# Altium schematic sheet Schematic1.SchDoc
size A4
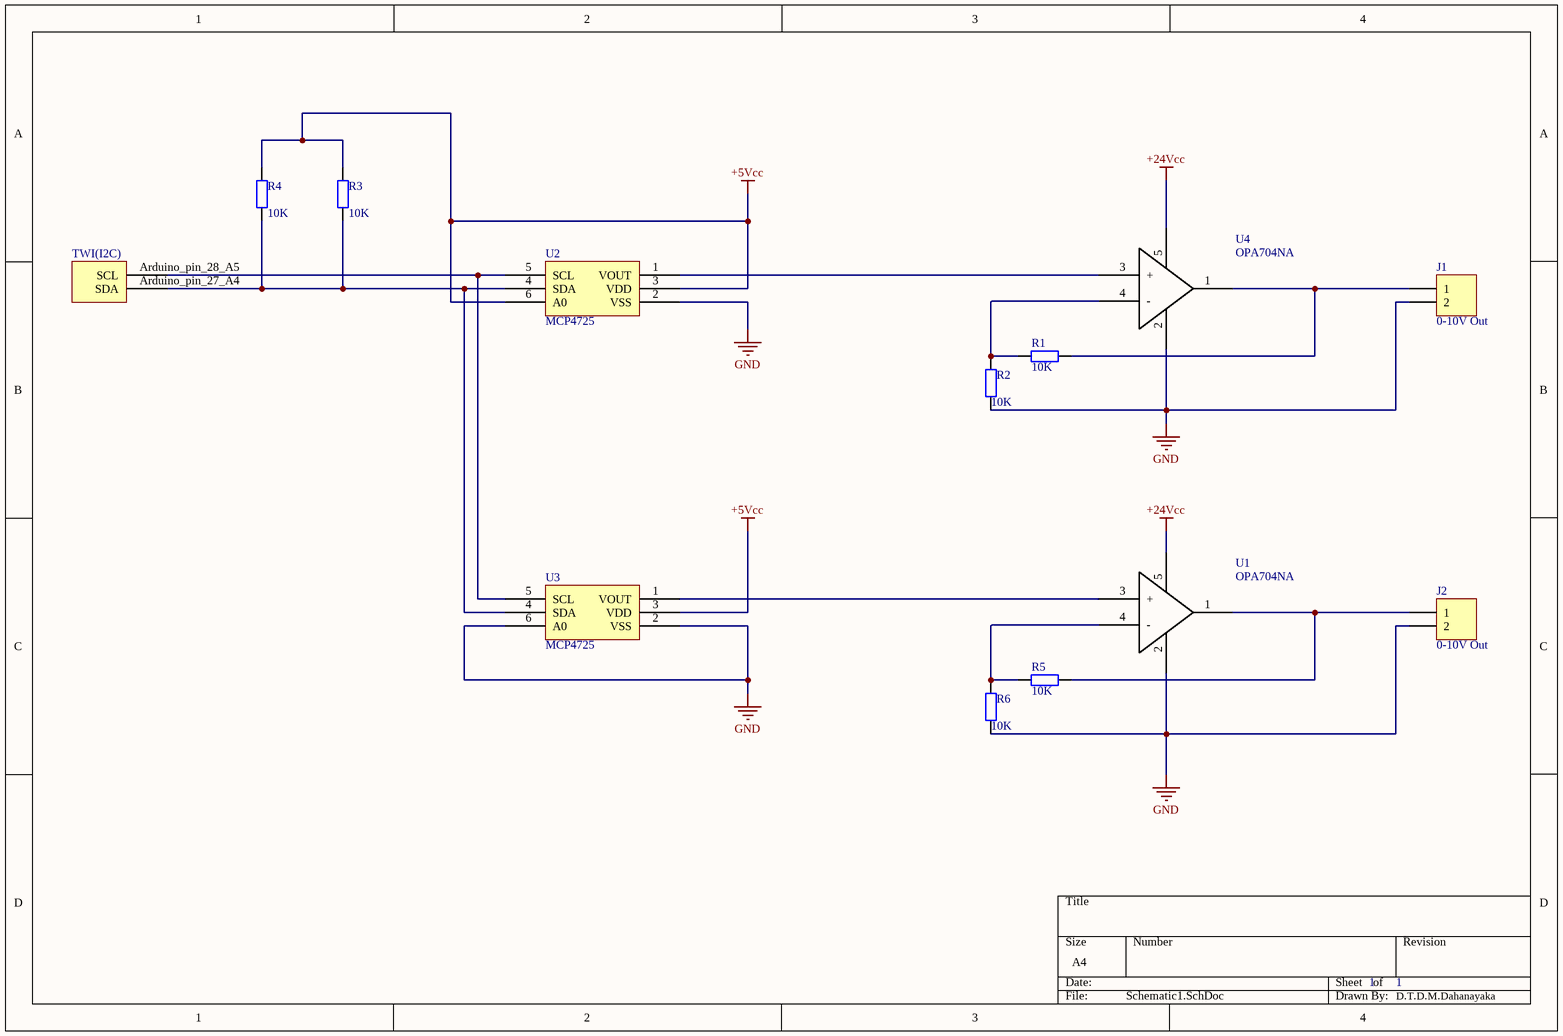
[diagram p0: Schematic1.SchDoc]

## Parts
J1  0-10V Out  [HDR1X2]
J2  0-10V Out  [HDR1X2]
R1  value 10K  [AXIAL-0.4]  (hidden comment: Res2)
R2  value 10K  [AXIAL-0.4]  (hidden comment: Res2)
R3  value 10K  [AXIAL-0.4]  (hidden comment: Res2)
R4  value 10K  [AXIAL-0.4]  (hidden comment: Res2)
R5  value 10K  [AXIAL-0.4]  (hidden comment: Res2)
R6  value 10K  [AXIAL-0.4]  (hidden comment: Res2)
TWI(I2C)  Component_1  (value not drawn)
U1  OPA704NA
U2  MCP4725
U3  MCP4725
U4  OPA704NA

## Nets
+5Vcc: R3.2 R4.2 U2.3(VDD) U2.6(A0) U3.3(VDD)
+24Vcc: U1.5 U4.5
GND: J1.2 J2.2 R2.1 R6.1 U1.2 U2.2(VSS) U3.2(VSS) U3.6(A0) U4.2
NetJ1_1: J1.1 R1.1 U4.1
NetJ2_1: J2.1 R5.1 U1.1
NetR1_2: R1.2 R2.2 U4.4(-)
NetR3_1: R3.1 R4.1 TWI(I2C).Arduino_pin_27_A4(SDA) U2.4(SDA) U3.4(SDA)
NetR5_2: R5.2 R6.2 U1.4(-)
NetTWI(I2C)_Arduino_pin_28_A5: TWI(I2C).Arduino_pin_28_A5(SCL) U2.5(SCL) U3.5(SCL)
NetU1_3: U1.3(+) U3.1(VOUT)
NetU2_1: U2.1(VOUT) U4.3(+)

## Notes on the sheet
- 1
- D.T.D.M.Dahanayaka

## Library data of the parts
J1 J2 = Header 2: Header, 2-Pin; LatestRevisionDate: 17-Jul-2002; LatestRevisionNote: Re-released for DXP Platform.; Publisher: Altium Limited
R1-R6 = Res2: Resistor; Published: 8-Jun-2000; LatestRevisionDate: 17-Jul-2002; LatestRevisionNote: Re-released for DXP Platform.; PackageReference: AXIAL-0.4; Publisher: Altium Limited; PackageDescription: Axial Device, Thru-Hole; 2 Leads; 0.4 in Pin Spacing
U1-U4 = Component_1